# EAGLE design Blinds_Stepper (EAGLE 6.5.0)
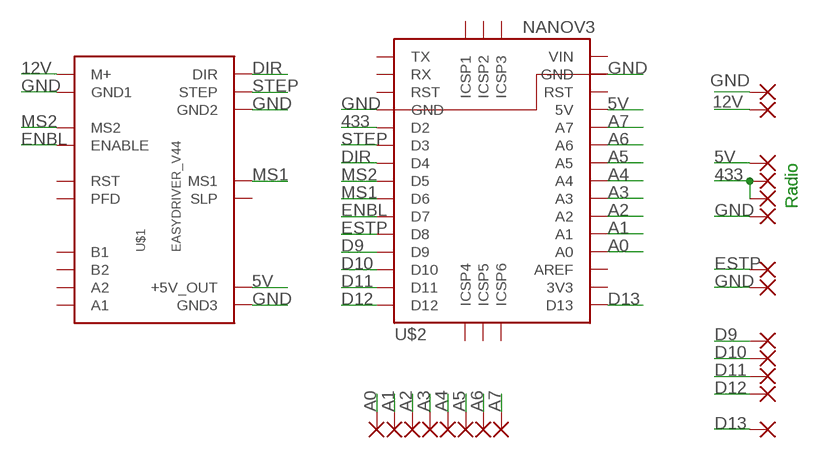
[diagram p0: schematic, sheet 1]

## Parts
+12  1,6/0,8  [1,6/0,8]
A0  1,6/0,8  [1,6/0,8]
A1  1,6/0,8  [1,6/0,8]
A2  1,6/0,8  [1,6/0,8]
A3  1,6/0,8  [1,6/0,8]
A4  1,6/0,8  [1,6/0,8]
A5  1,6/0,8  [1,6/0,8]
A6  1,6/0,8  [1,6/0,8]
A7  1,6/0,8  [1,6/0,8]
D1  1,6/0,8  [1,6/0,8]
D9  1,6/0,8  [1,6/0,8]
D10  1,6/0,8  [1,6/0,8]
D11  1,6/0,8  [1,6/0,8]
D12  1,6/0,8  [1,6/0,8]
END+  1,6/0,8  [1,6/0,8]
END-  1,6/0,8  [1,6/0,8]
GND  1,6/0,8  [1,6/0,8]
R1  1,6/0,8  [1,6/0,8]
R2  1,6/0,8  [1,6/0,8]
R+  1,6/0,8  [1,6/0,8]
R-  1,6/0,8  [1,6/0,8]
U$1  EASYDRIVER_V44  [EASYDRIVER_V44]
U$2  NANOV3  [NANOV3]

## Nets
5V: R+.1(P) U$1.P$11(+5V_OUT) U$2.5V
12V: +12.1(P) U$1.M+
433: R1.1(P) R2.1(P) U$2.D2
A0: A0.1(P) U$2.A0
A1: A1.1(P) U$2.A1
A2: A2.1(P) U$2.A2
A3: A3.1(P) U$2.A3
A4: A4.1(P) U$2.A4
A5: A5.1(P) U$2.A5
A6: A6.1(P) U$2.A6
A7: A7.1(P) U$2.A7
D9: D9.1(P) U$2.D9
D10: D10.1(P) U$2.D10
D11: D11.1(P) U$2.D11
D12: D12.1(P) U$2.D12
D13: D1.1(P) U$2.D13
DIR: U$1.DIR U$2.D4
ENBL: U$1.ENABLE U$2.D7
ESTP: END+.1(P) U$2.D8
GND: END-.1(P) GND.1(P) R-.1(P) U$1.GND1 U$1.GND2 U$1.GND3 U$2.GND1(GND) U$2.GND2(GND)
MS1: U$1.MS1 U$2.D6
MS2: U$1.MS2 U$2.D5
STEP: U$1.STEP U$2.D3
Unconnected: U$1.A1 U$1.A2 U$1.B1 U$1.B2 U$1.PFD U$1.RST U$1.SLEEP(SLP) U$2.3V3 U$2.AREF U$2.P$31(ICSP4) U$2.P$32(ICSP5) U$2.P$33(ICSP6) U$2.P$34(ICSP1) U$2.P$35(ICSP2) U$2.P$36(ICSP3) U$2.RST1(RST) U$2.RST2(RST) U$2.RX U$2.TX

## Notes on the sheet
- Radio

## Power pins joined to a net without a drawn wire
VIN: U$2.VIN

## Library data of the parts
+12 A0 A1-A7 D1 D9-D12 END+ END- GND R1 R2 R+ R- = wirepad:1,6/0,8: THROUGH-HOLE PAD
U$1 = EasyDriver:EASYDRIVER_V44: EasyDriver version 4.4 - http://www.schmalzhaus.com/EasyDriver
U$2 = Franc:NANOV3: Arduino Nano Version 3 (v3)

## Board
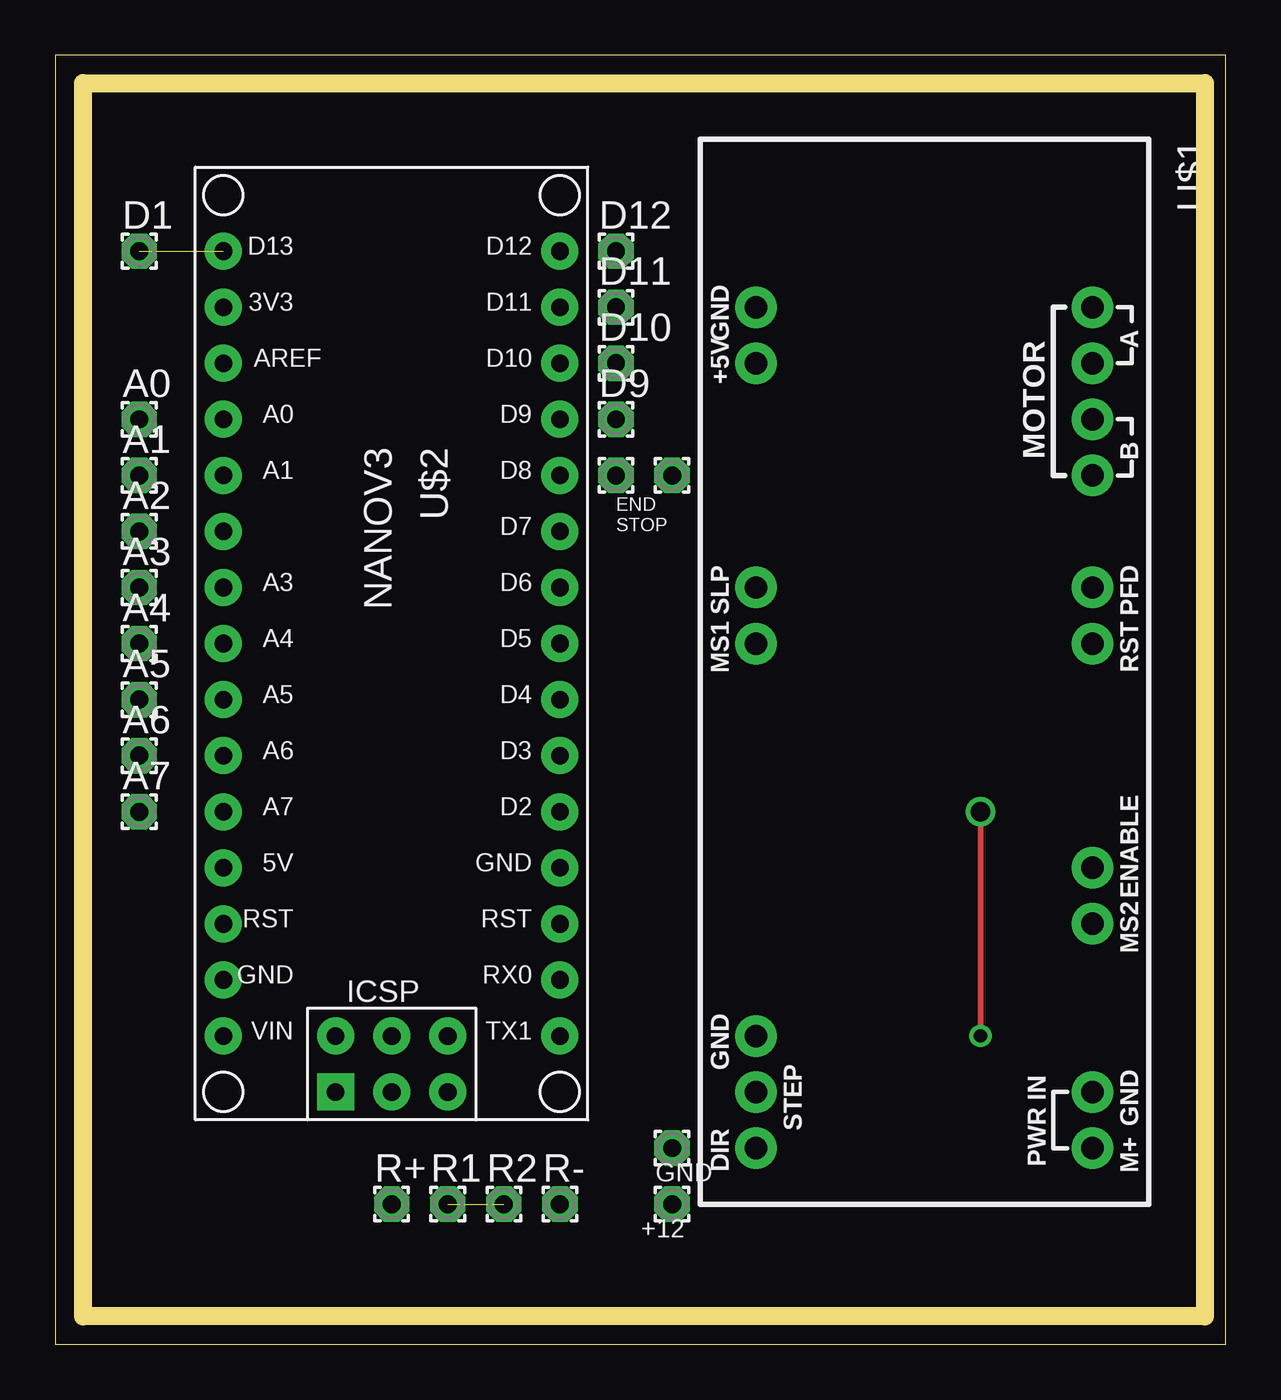
[diagram p1: board, top side]
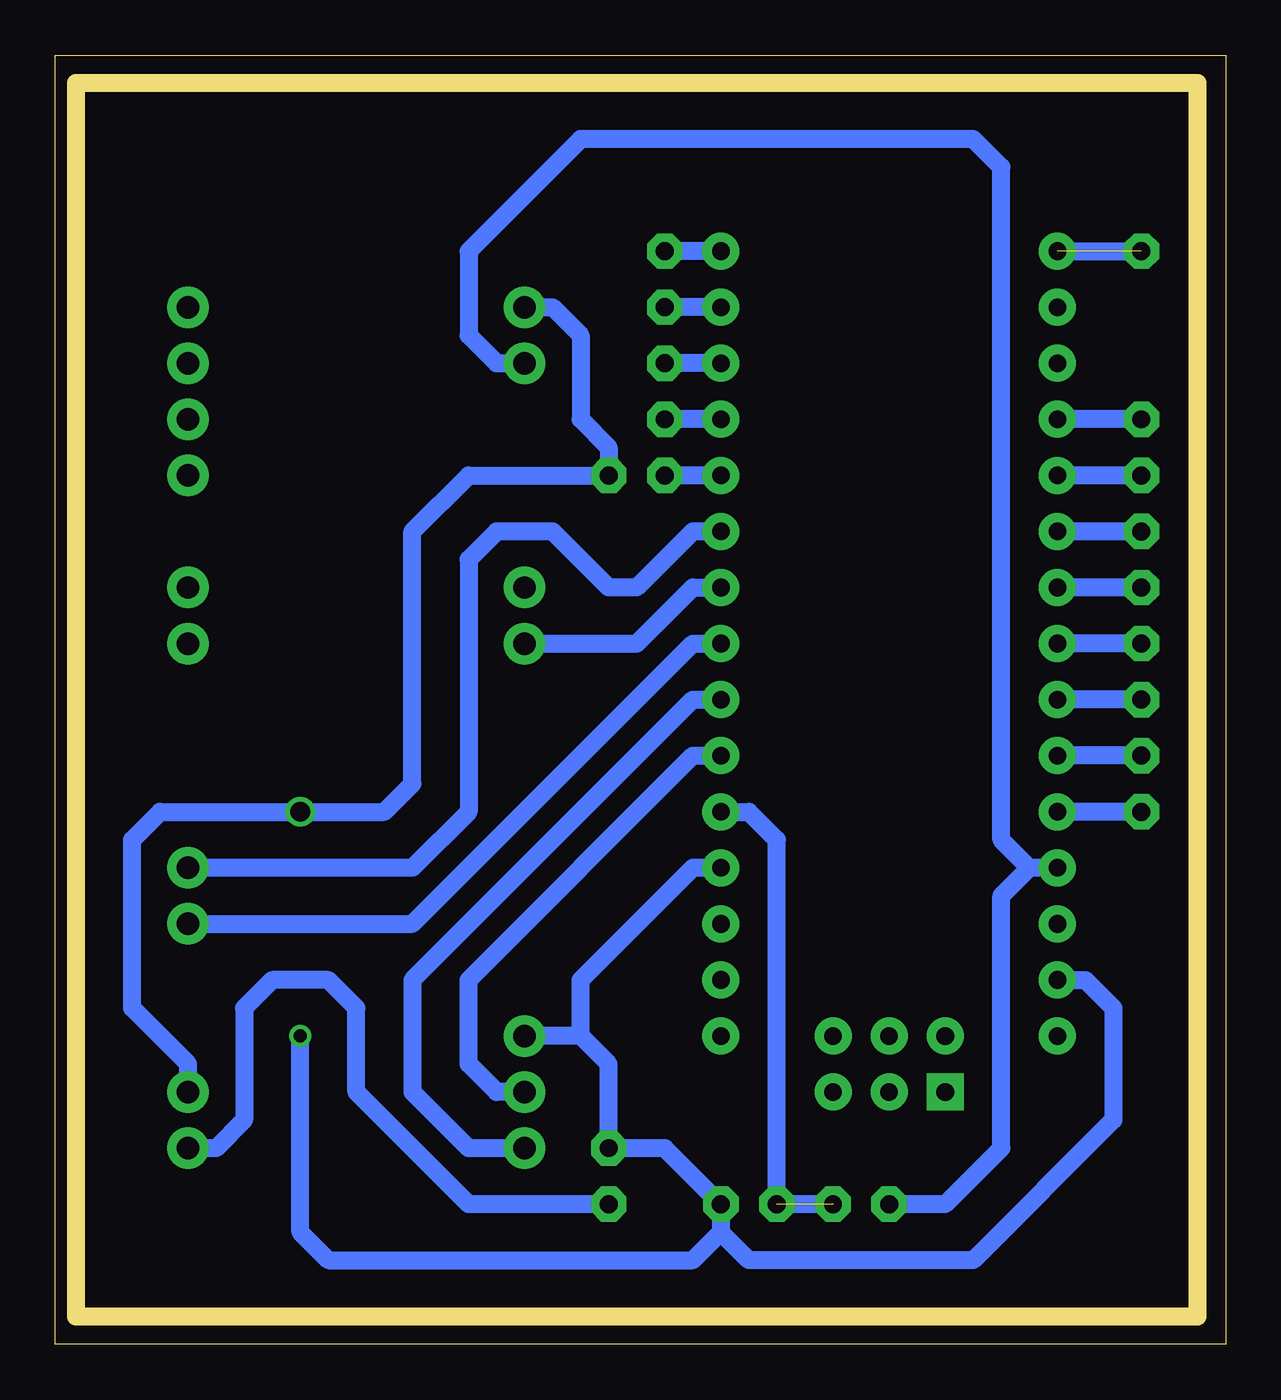
[diagram p2: board, bottom side, seen from below]

Size 53.01 x 58.41 mm. Coordinates in mm from the lower left corner, seen from the top.
Outline: 0,0 53.01,0 53.01,58.41 0,58.41 0,0
Copper layers (1*16): Top 0.035mm / dielectric 1.5mm / Bottom 0.035mm
Design rules "default": minimum track width 10mil, minimum drill 24mil, track to track 8mil, track to pad 8mil, pad to pad 8mil, via to via 8mil, smd to smd 8mil, copper to edge 40mil, drill to drill 8mil, minimum pad ring 10mil, minimum via ring 8mil, stop-mask expansion 4mil, vias tented up to drill 0mil, thermal gap 10mil
Milling: 4 lines

### Footprints (pad centres in the part's own frame; a part is rotated, then mirrored left to right if it is on the bottom)
1,6/0,8 = drill 0.813 pad 1.6 octagon: 1 0,0
EASYDRIVER_V44 = drill 1.016 pad 1.88: A1 -16.51,7.62; A2 -13.97,7.62; B1 -8.89,7.62; B2 -11.43,7.62; DIR 21.59,-7.62; ENABLE 8.89,7.62; GND1 19.05,7.62; GND2 16.51,-7.62; GND3 -16.51,-7.62; M+ 21.59,7.62; MS1 -1.27,-7.62; MS2 11.43,7.62; P$11 -13.97,-7.62; PFD -3.81,7.62; RST -1.27,7.62; SLEEP -3.81,-7.62; STEP 19.05,-7.62
NANOV3 = drill 0.8 pad 1.676: 3V3 7.62,-15.24; 5V 7.62,10.16; A0 7.62,-10.16; A1 7.62,-7.62; A2 7.62,-5.08; A3 7.62,-2.54; A4 7.62,0; A5 7.62,2.54; A6 7.62,5.08; A7 7.62,7.62; AREF 7.62,-12.7; D2 -7.62,7.62; D3 -7.62,5.08; D4 -7.62,2.54; D5 -7.62,0; D6 -7.62,-2.54; D7 -7.62,-5.08; D8 -7.62,-7.62; D9 -7.62,-10.16; D10 -7.62,-12.7; D11 -7.62,-15.24; D12 -7.62,-17.78; D13 7.62,-17.78; GND1 -7.62,10.16; GND2 7.62,15.24; P$31 -2.54,20.32; P$32 0,20.32; P$34 2.54,17.78; P$35 0,17.78; P$36 -2.54,17.78; RST1 -7.62,12.7; RST2 7.62,12.7; RX -7.62,15.24; TX -7.62,17.78; VIN 7.62,17.78 | drill 0.8 pad 1.676 square: P$33 2.54,20.32

### Placement (x,y rotation side)
+12  27.94,6.35 0 top
A0  3.81,41.91 0 top
A1  3.81,39.37 0 top
A2  3.81,36.83 0 top
A3  3.81,34.29 0 top
A4  3.81,31.75 0 top
A5  3.81,29.21 0 top
A6  3.81,26.67 0 top
A7  3.81,24.13 0 top
D1  3.81,49.53 0 top
D9  25.4,41.91 0 top
D10  25.4,44.45 0 top
D11  25.4,46.99 0 top
D12  25.4,49.53 0 top
END+  25.4,39.37 0 top
END-  27.94,39.37 0 top
GND  27.94,8.89 0 top
R1  17.78,6.35 0 top
R2  20.32,6.35 0 top
R+  15.24,6.35 0 top
R-  22.86,6.35 0 top
U$1  39.37,30.48 270 top
U$2  15.24,31.75 180 top

### Tracks (layer width: path | path; a pad name or v marks a point on that pad's centre or on a via)
5V
  Bottom 0.813: U$2.5V 8.89,21.59 | U$1.P$11 33.02,44.45 34.29,45.72 34.29,49.53 29.21,54.61 11.43,54.61 10.16,53.34 10.16,22.86 8.89,21.59 | R+.1 12.7,6.35 10.16,8.89 10.16,20.32 8.89,21.59
12V
  Bottom 0.813: +12.1 34.29,6.35 39.37,11.43 39.37,15.24 40.64,16.51 43.18,16.51 44.45,15.24 44.45,10.16 45.72,8.89 U$1.M+
433  (1 unrouted)
  Bottom 0.813: U$2.D2 21.59,24.13 20.32,22.86 R2.1 R1.1
A0
  Bottom 0.813: A0.1 U$2.A0
A1
  Bottom 0.813: A1.1 U$2.A1
A2
  Bottom 0.813: A2.1 U$2.A2
A3
  Bottom 0.813: A3.1 U$2.A3
A4
  Bottom 0.813: A4.1 U$2.A4
A5
  Bottom 0.813: A5.1 U$2.A5
A6
  Bottom 0.813: A6.1 U$2.A6
A7
  Bottom 0.813: A7.1 U$2.A7
D9
  Bottom 0.813: U$2.D9 D9.1
D10
  Bottom 0.813: U$2.D10 D10.1
D11
  Bottom 0.813: U$2.D11 D11.1
D12
  Bottom 0.813: U$2.D12 D12.1
D13  (1 unrouted)
  Bottom 0.813: U$2.D13 D1.1
DIR
  Bottom 0.813: U$1.DIR 34.29,8.89 36.83,11.43 36.83,16.51 24.13,29.21 U$2.D4
ENBL
  Bottom 0.813: U$1.ENABLE 36.83,21.59 34.29,24.13 34.29,35.56 33.02,36.83 30.48,36.83 27.94,34.29 26.67,34.29 24.13,36.83 U$2.D7
ESTP
  Bottom 0.813: U$2.D8 END+.1
GND  (via drill 0.6, 0.9)
  Top 0.254: v41.91,13.97 v41.91,24.13
  Bottom 0.813: U$1.GND1 46.99,12.7 49.53,15.24 49.53,22.86 48.26,24.13 v41.91,24.13 38.1,24.13 36.83,25.4 36.83,36.83 34.29,39.37 END-.1 27.94,40.64 29.21,41.91 29.21,45.72 30.48,46.99 U$1.GND3 | 29.21,13.97 27.94,12.7 GND.1 25.4,8.89 R-.1 22.86,5.08 | 29.21,13.97 U$1.GND2 | U$2.GND2 6.35,16.51 5.08,15.24 5.08,10.16 11.43,3.81 21.59,3.81 22.86,5.08 | U$2.GND1 24.13,21.59 29.21,16.51 29.21,13.97 | v41.91,13.97 41.91,5.08 40.64,3.81 24.13,3.81 22.86,5.08
MS1
  Bottom 0.813: U$1.MS1 26.67,31.75 24.13,34.29 U$2.D6
MS2
  Bottom 0.813: U$1.MS2 36.83,19.05 24.13,31.75 U$2.D5
STEP
  Bottom 0.813: U$1.STEP 33.02,11.43 34.29,12.7 34.29,16.51 24.13,26.67 U$2.D3

### Text on the board
tNames: END / STOP